# Altium project V5_BASE_V17.PrjPcb
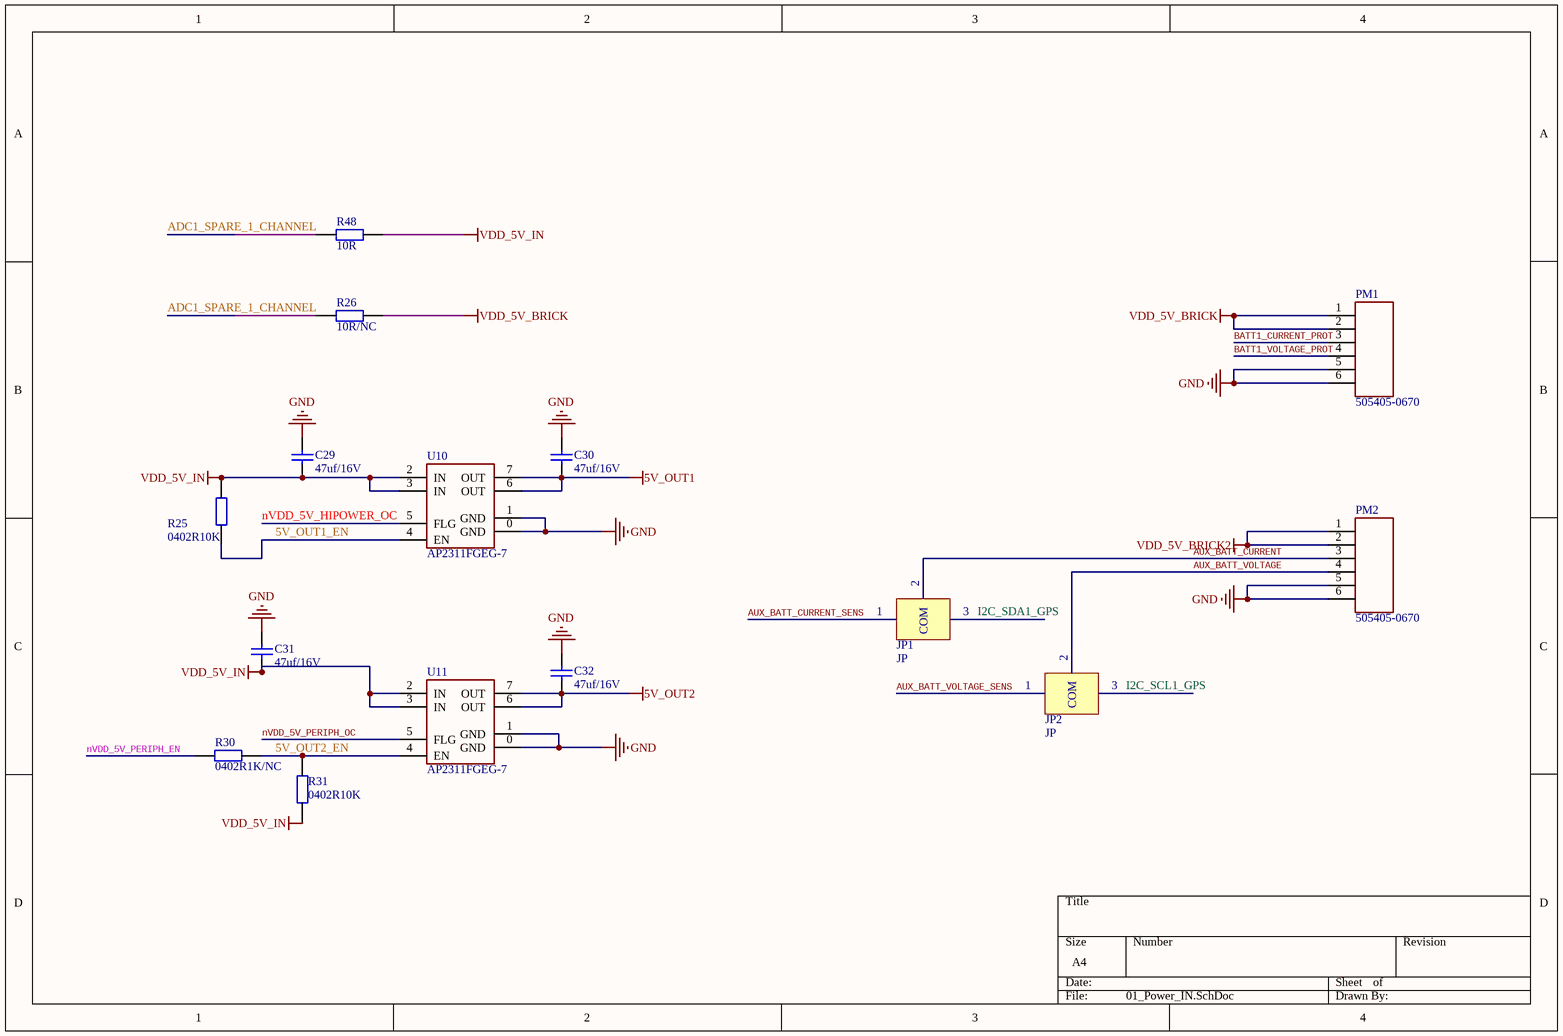
[diagram p0: 01_Power_IN.SchDoc]
6 sheets, 133 parts. Net scope: global (net labels, ports and power ports of the same name join across sheets).
Board file: V5_BASE_V17.PcbDoc
Sheets:
  01_Power_IN.SchDoc
  02_B_TO_B_CON.SchDoc
  03_Power_Switch.SchDoc
  05_DATA_IO.SchDoc
  06_PWM_IO.SchDoc
  08_PX4IO_V2.SchDoc

## Sheet 01_Power_IN.SchDoc
size A4

### Parts
C29  47uf/16V  [0805CAP]
C30  47uf/16V  [0805CAP]
C31  47uf/16V  [0805CAP]
C32  47uf/16V  [0805CAP]
JP1  JP  [0402R-SR]
JP2  JP  [0402R-SR]
PM1  505405-0670  [5054050660]
PM2  505405-0670  [5054050660]
R25  0402R10K  [0402R]
R26  10R/NC  [0402R]
R30  0402R1K/NC  [0402R]
R31  0402R10K  [0402R]
R48  10R  [0402R]
U10  AP2311FGEG-7  [QFN8_0.65]
U11  AP2311FGEG-7  [QFN8_0.65]

### Nets
5V_OUT1: C30.1 U10.6(OUT) U10.7(OUT)
5V_OUT2: C32.1 U11.6(OUT) U11.7(OUT)
GND: C29.2 C30.2 C31.2 C32.2 PM1.5 PM1.6 PM2.5 PM2.6 U10.0(GND) U10.1(GND) U11.0(GND) U11.1(GND)
VDD_5V_BRICK: PM1.1 PM1.2 R26.2
VDD_5V_BRICK2: PM2.1 PM2.2
VDD_5V_IN: C29.1 C31.1 R25.2 R31.2 R48.2 U10.2(IN) U10.3(IN) U11.2(IN) U11.3(IN)
5V_OUT1_EN: R25.1 U10.4(EN)
5V_OUT2_EN: R30.1 R31.1 U11.4(EN)
ADC1_SPARE_1_CHANNEL: R26.1 R48.1
AUX_BATT_CURRENT: JP1.2(COM) PM2.3
AUX_BATT_CURRENT_SENS: JP1.1
AUX_BATT_VOLTAGE: JP2.2(COM) PM2.4
AUX_BATT_VOLTAGE_SENS: JP2.1
BATT1_CURRENT_PROT: PM1.3
BATT1_VOLTAGE_PROT: PM1.4
I2C_SCL1_GPS: JP2.3
I2C_SDA1_GPS: JP1.3
nVDD_5V_HIPOWER_OC: U10.5(FLG)
nVDD_5V_PERIPH_EN: R30.2
nVDD_5V_PERIPH_OC: U11.5(FLG)

### Library data of the parts
C29-C32 = Cap: Capacitor
JP1 JP2 = 0402R-SR
PM1 PM2 = 5054050660
R25 R26 R30 R31 R48 = 0402R1K: 0402R1K 1%

## Sheet 02_B_TO_B_CON.SchDoc: PixHack V5 Base v1.82
size A4; CompanyName: CUAV Ltd; DrawnBy: bin; Revision: V1.82
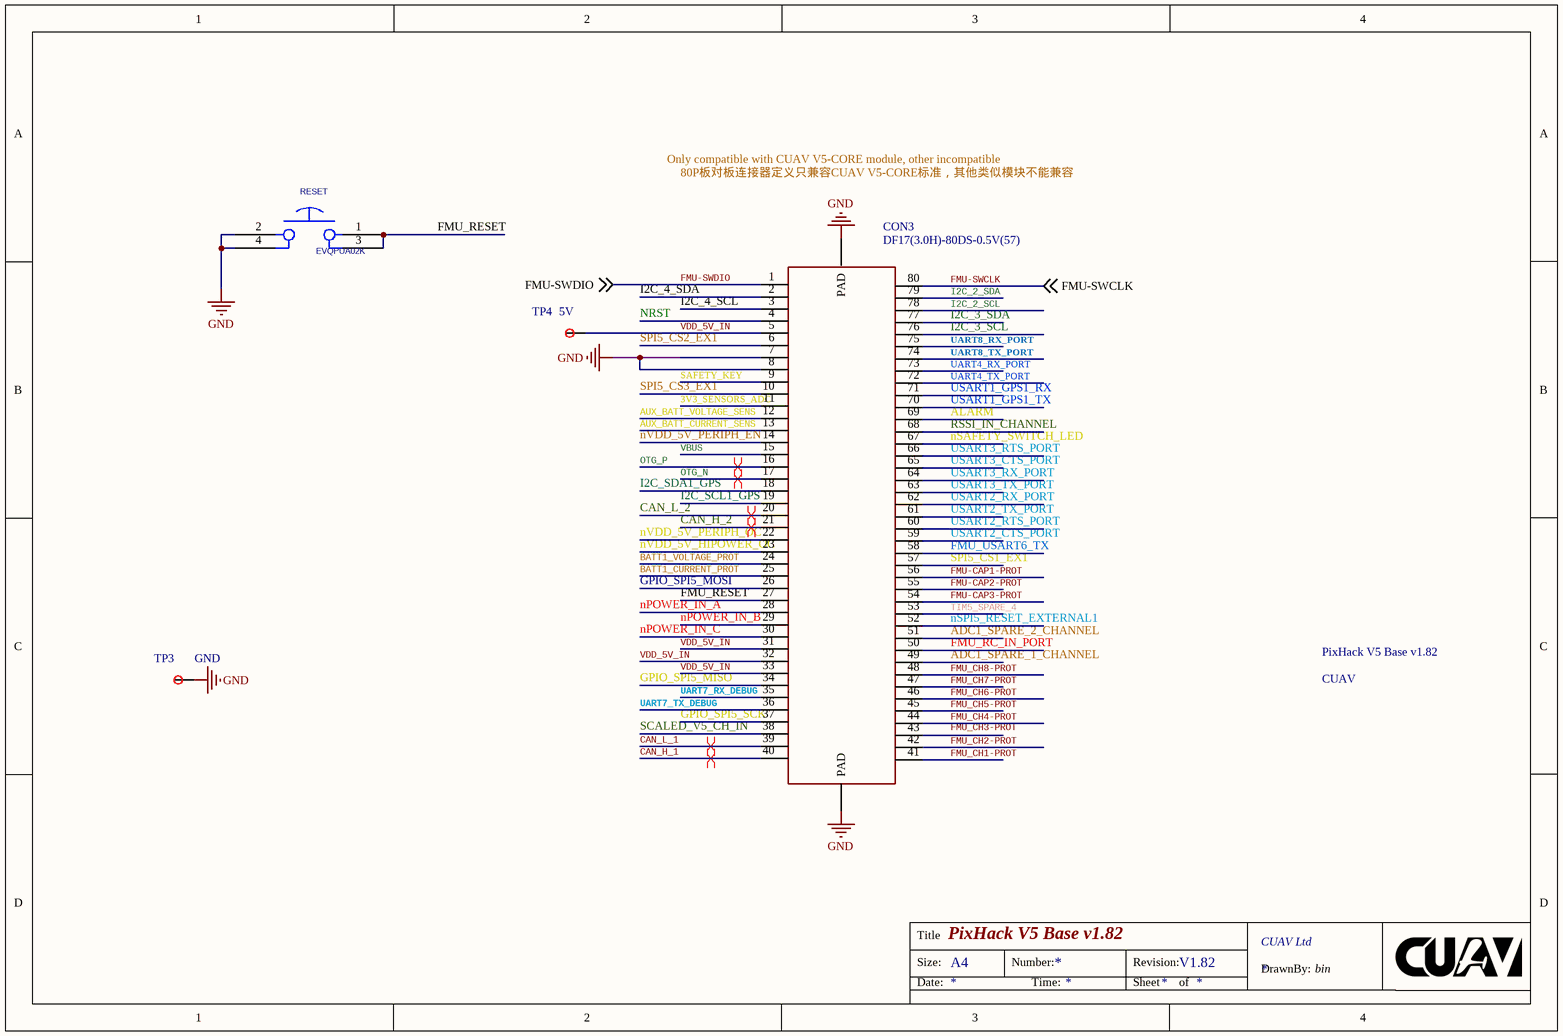
[diagram p1: 02_B_TO_B_CON.SchDoc]

### Parts
CON3  DF17(3.0H)-80DS-0.5V(57)  [DF17(3.0H)-80DS-0.5V(57)]
PixHack_V5_Base_v1.82  CUAV  [CUAV_G]
RESET  EVQPUA02K  [SKRPAB]
TP3  GND  [TP0.75]
TP4  5V  [TP0.75]

### Nets
GND: CON3.7 CON3.8 CON3.PAD RESET.2 RESET.4 TP3.0
VBUS: CON3.15
VDD_5V_IN: CON3.5 CON3.31 CON3.32 CON3.33 TP4.0
3V3_SENSORS_ADC: CON3.11
ADC1_SPARE_1_CHANNEL: CON3.49
ADC1_SPARE_2_CHANNEL: CON3.51
ALARM: CON3.69
AUX_BATT_CURRENT_SENS: CON3.13
AUX_BATT_VOLTAGE_SENS: CON3.12
BATT1_CURRENT_PROT: CON3.25
BATT1_VOLTAGE_PROT: CON3.24
CAN_H_1: CON3.40
CAN_H_2: CON3.21
CAN_L_1: CON3.39
CAN_L_2: CON3.20
FMU-CAP1-PROT: CON3.56
FMU-CAP2-PROT: CON3.55
FMU-CAP3-PROT: CON3.54
FMU-SWCLK: CON3.80 ; off-sheet FMU-SWCLK
FMU-SWDIO: CON3.1 ; off-sheet FMU-SWDIO
FMU_CH1-PROT: CON3.41
FMU_CH2-PROT: CON3.42
FMU_CH4-PROT: CON3.44
FMU_CH5-PROT: CON3.45
FMU_CH6-PROT: CON3.46
FMU_CH7-PROT: CON3.47
FMU_CH8-PROT: CON3.48
FMU_RC_IN_PORT: CON3.50
FMU_RESET: CON3.27 RESET.1 RESET.3
FMU_USART6_TX: CON3.58
GPIO_SPI5_MISO: CON3.34
GPIO_SPI5_MOSI: CON3.26
GPIO_SPI5_SCK: CON3.37
I2C_2_SCL: CON3.78
I2C_2_SDA: CON3.79
I2C_3_SCL: CON3.76
I2C_3_SDA: CON3.77
I2C_4_SCL: CON3.3
I2C_4_SDA: CON3.2
I2C_SCL1_GPS: CON3.19
I2C_SDA1_GPS: CON3.18
nPOWER_IN_A: CON3.28
nPOWER_IN_B: CON3.29
nPOWER_IN_C: CON3.30
NRST: CON3.4
nSAFETY_SWITCH_LED: CON3.67
nSPI5_RESET_EXTERNAL1: CON3.52
nVDD_5V_HIPOWER_OC: CON3.23
nVDD_5V_PERIPH_EN: CON3.14
nVDD_5V_PERIPH_OC: CON3.22
OTG_N: CON3.17
OTG_P: CON3.16
RSSI_IN_CHANNEL: CON3.68
SAFETY_KEY: CON3.9
SCALED_V5_CH_IN: CON3.38
SPI5_CS1_EX1: CON3.57
SPI5_CS2_EX1: CON3.6
SPI5_CS3_EX1: CON3.10
TIM5_SPARE_4: CON3.53
UART4_RX_PORT: CON3.73
UART4_TX_PORT: CON3.72
UART7_RX_DEBUG: CON3.35
UART7_TX_DEBUG: CON3.36
UART8_RX_PORT: CON3.75
UART8_TX_PORT: CON3.74
USART1_GPS1_RX: CON3.71
USART1_GPS1_TX: CON3.70
USART2_CTS_PORT: CON3.59
USART2_RTS_PORT: CON3.60
USART2_RX_PORT: CON3.62
USART2_TX_PORT: CON3.61
USART3_CTS_PORT: CON3.65
USART3_RTS_PORT: CON3.66
USART3_RX_PORT: CON3.64
USART3_TX_PORT: CON3.63

Not connected (* = marked no-connect by the designer): CON3 43

### Layout directives
differential pair: CAN_H_1, CAN_H_2, CAN_L_1, CAN_L_2, OTG_N, OTG_P

### Notes on the sheet
- Labels drawn without touching a wire or pin: 80P板对板连接器定义只兼容CUAV V5-CORE标准，其他类似模块不能兼容, FMU_CH3-PROT, Only compatible with CUAV V5-CORE module, other incompatible
- Title
- Size:
- Date:
- A4
- Number:
- Time:
- Revision:
- Sheet
- of
- DrawnBy:

### Library data of the parts
RESET = EDGE_MOUNT_PB_SW_2: SW SPST NO PB 2.2N SIDE 12V 50MA SMT; CLASS: IC; CAD_APPROVED: Yes; MFG_NAME01: PANASONIC; AGILE_PN: 510-76838; HEIGHT: 1.95MM; ROHS: Yes; MFG_PN01: EVQPUA02K
TP3 TP4 = TP_0.75: TP_0.75MM

## Sheet 03_Power_Switch.SchDoc
size A4
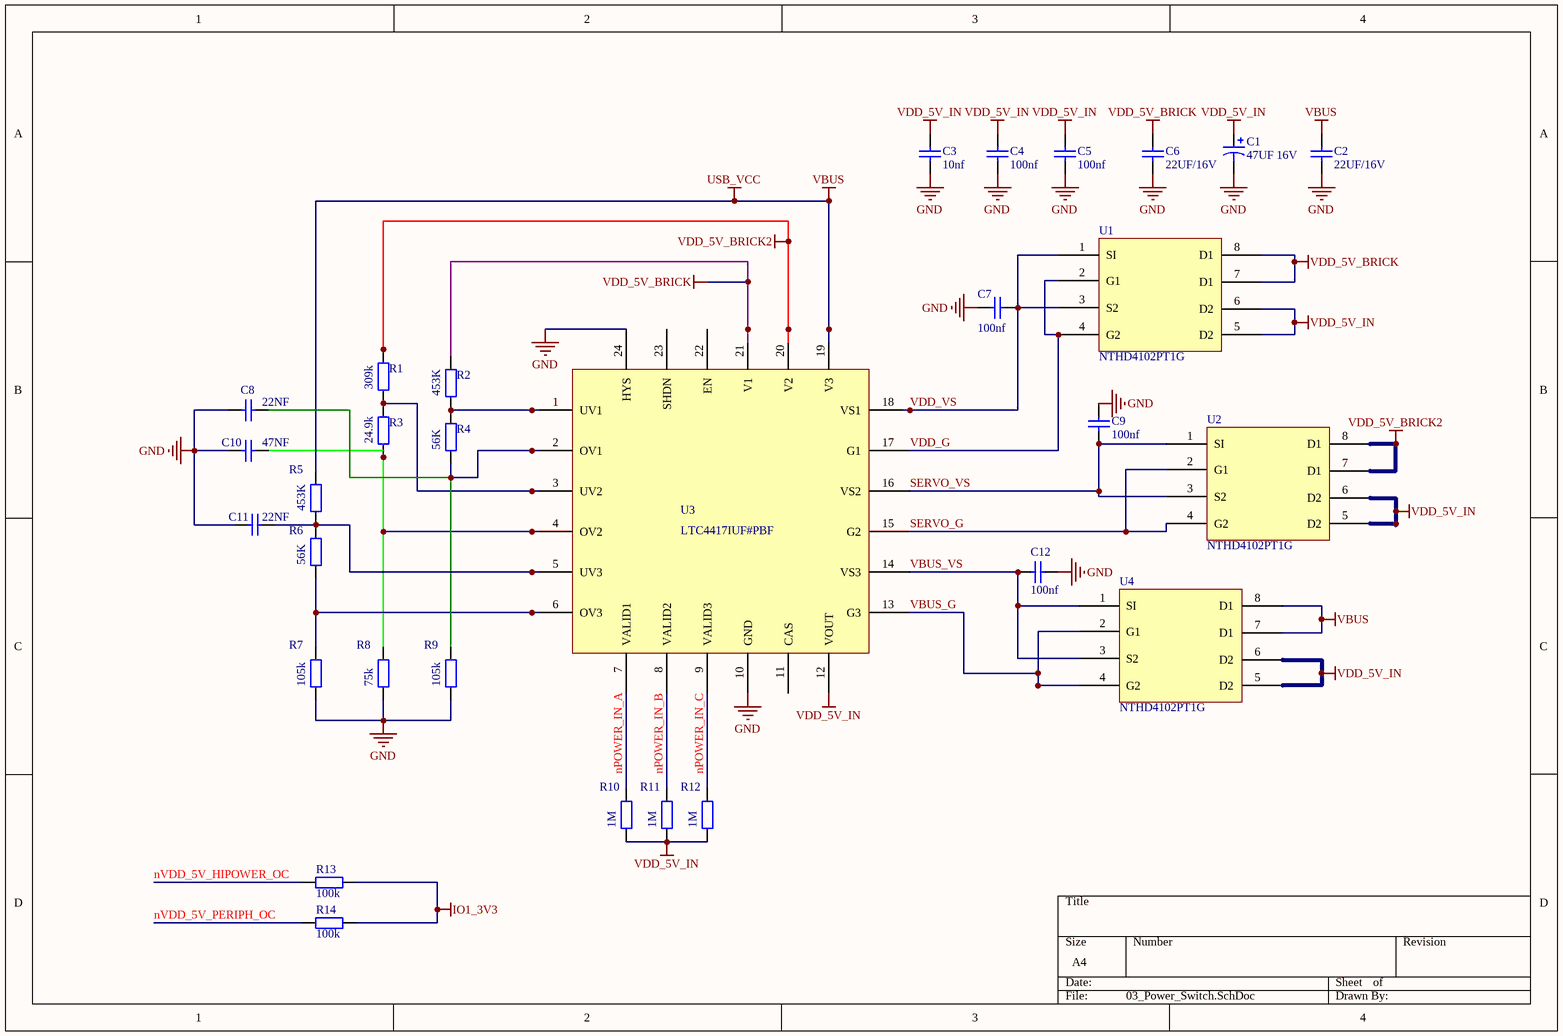
[diagram p2: 03_Power_Switch.SchDoc]

### Parts
C1  47UF 16V  [7343CAP]
C2  22UF/16V  [0805CAP]
C3  10nf  [0402CAP]
C4  100nf  [0402CAP]
C5  100nf  [0402CAP]
C6  22UF/16V  [0805CAP]
C7  100nf  [0402CAP]
C8  22NF  [0402CAP]
C9  100nf  [0402CAP]
C10  47NF  [0402CAP]
C11  22NF  [0402CAP]
C12  100nf  [0402CAP]
R1  309k  [R0402]
R2  453K  [R0402]
R3  24.9k  [R0402]
R4  56K  [R0402]
R5  453K  [R0402]
R6  56K  [R0402]
R7  105k  [R0402]
R8  75k  [R0402]
R9  105k  [R0402]
R10  1M  [R0402]
R11  1M  [R0402]
R12  1M  [R0402]
R13  100k  [R0402]
R14  100k  [R0402]
U1  NTHD4102PT1G  [1206-8]
U2  NTHD4102PT1G  [1206-8]
U3  LTC4417IUF#PBF  [QFN24]
U4  NTHD4102PT1G  [1206-8]

### Nets
GND: C1.C C2.1 C3.1 C4.1 C5.1 C6.1 C7.2 C8.2 C9.2 C10.2 C11.2 C12.2 R7.1 R8.1 R9.1 U3.10(GND) U3.24(HYS)
IO1_3V3: R13.2 R14.2
VBUS: C2.2 R5.2 U3.19(V3) U4.7(D1) U4.8(D1)  [also labelled USB_VCC]
VDD_5V_BRICK: C6.2 R2.2 U1.7(D1) U1.8(D1) U3.21(V1)
VDD_5V_BRICK2: R1.2 U2.7(D1) U2.8(D1) U3.20(V2)
VDD_5V_IN: C1.A C3.2 C4.2 C5.2 R10.1 R11.1 R12.1 U1.5(D2) U1.6(D2) U2.5(D2) U2.6(D2) U3.12(VOUT) U4.5(D2) U4.6(D2)
nPOWER_IN_A: R10.2 U3.7(VALID1)
nPOWER_IN_B: R11.2 U3.8(VALID2)
nPOWER_IN_C: R12.2 U3.9(VALID3)
nVDD_5V_HIPOWER_OC: R13.1
nVDD_5V_PERIPH_OC: R14.1
SERVO_G: U2.2(G1) U2.4(G2) U3.15(G2)
SERVO_VS: C9.1 U2.1(SI) U2.3(S2) U3.16(VS2)
VBUS_G: U3.13(G3) U4.2(G1) U4.4(G2)
VBUS_VS: C12.1 U3.14(VS3) U4.1(SI) U4.3(S2)
VDD_G: U1.2(G1) U1.4(G2) U3.17(G1)
VDD_VS: C7.1 U1.1(SI) U1.3(S2) U3.18(VS1)
NetC8_1: C8.1 R4.1 R9.2 U3.2(OV1)
NetC10_1: C10.1 R3.1 R8.2 U3.4(OV2)
NetC11_1: C11.1 R5.1 R6.2 U3.5(UV3)
NetR1_1: R1.1 R3.2 U3.3(UV2)
NetR2_1: R2.1 R4.2 U3.1(UV1)
NetR6_1: R6.1 R7.2 U3.6(OV3)

Not connected (* = marked no-connect by the designer): U3 11(CAS) 22(EN) 23(SHDN)

### Library data of the parts
C1 = Cap Pol1: Polarized Capacitor (Radial); Value: 100pF; Published: 8-Jun-2000; LatestRevisionDate: 17-Jul-2002; LatestRevisionNote: Re-released for DXP Platform.; PackageReference: RB7.6-15; Publisher: Altium Limited; PackageDescription: Polarized Capacitor (Radial); 2 Leads
C2-C12 = Cap: Value: 100pF; Published: 8-Jun-2000; LatestRevisionDate: 17-Jul-2002; LatestRevisionNote: Re-released for DXP Platform.; PackageReference: RAD-0.3; Publisher: Altium Limited; PackageDescription: Radial Cap, Thru-Hole; 2 Leads; 0.3 in Pin Spacing
R1-R14 = Res2: Resistor; Value: 1K; Published: 8-Jun-2000; LatestRevisionDate: 17-Jul-2002; LatestRevisionNote: Re-released for DXP Platform.; PackageReference: AXIAL-0.4; Publisher: Altium Limited; PackageDescription: Axial Device, Thru-Hole; 2 Leads; 0.4 in Pin Spacing

## Sheet 05_DATA_IO.SchDoc
size A3
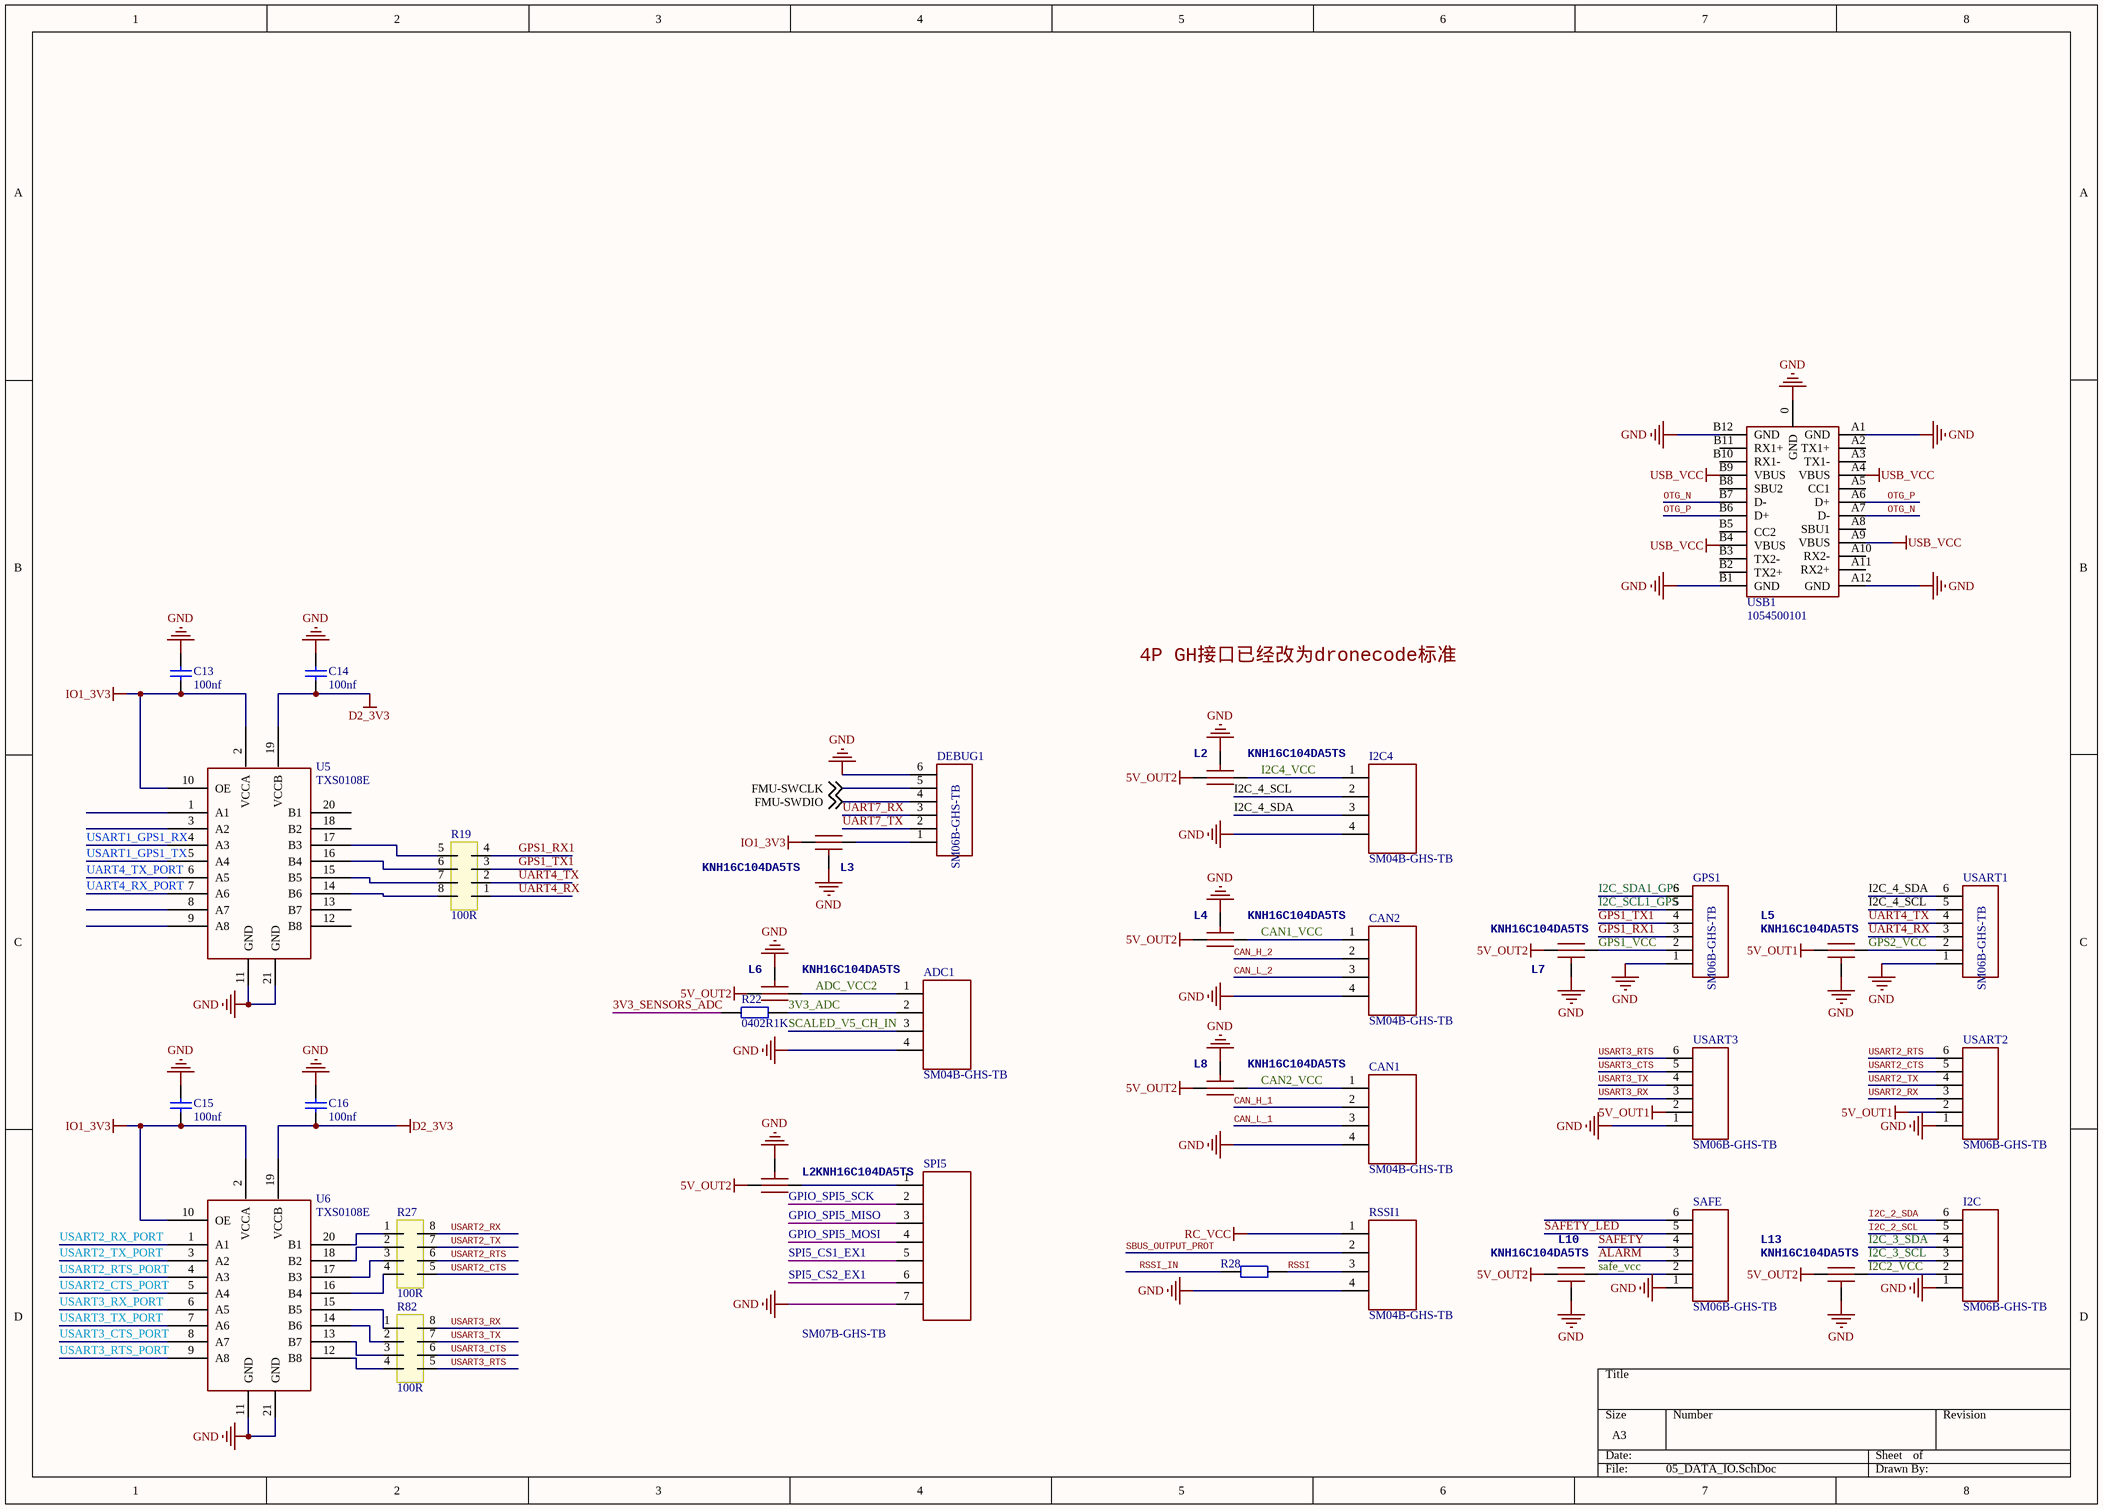
[diagram p3: 05_DATA_IO.SchDoc]

### Parts
(Parts that share a designator on the sheet are numbered #1, #2 ... from top to bottom, then left to right.)
ADC1  SM04B-GHS-TB  [BM04B-GHS_DC]
C13  100nf  [0402CAP]
C14  100nf  [0402CAP]
C15  100nf  [0402CAP]
C16  100nf  [0402CAP]
CAN1  SM04B-GHS-TB  [BM04B-GHS_DC]
CAN2  SM04B-GHS-TB  [BM04B-GHS_DC]
DEBUG1  SM06B-GHS-TB  [BM06B-GHS_DC]
GPS1  SM06B-GHS-TB  [SM06B-GHS-TB]
I2C  SM06B-GHS-TB  [SM06B-GHS-TB]
I2C4  SM04B-GHS-TB  [BM04B-GHS_DC]
L2#1  KNH16C104DA5TS  [KYOCERA-KNH16-DA]
L2#2  KNH16C104DA5TS  [KYOCERA-KNH16-DA]
L3  KNH16C104DA5TS  [KYOCERA-KNH16-DA]
L4  KNH16C104DA5TS  [KYOCERA-KNH16-DA]
L5  KNH16C104DA5TS  [KYOCERA-KNH16-DA]
L6  KNH16C104DA5TS  [KYOCERA-KNH16-DA]
L7  KNH16C104DA5TS  [KYOCERA-KNH16-DA]
L8  KNH16C104DA5TS  [KYOCERA-KNH16-DA]
L10  KNH16C104DA5TS  [KYOCERA-KNH16-DA]
L13  KNH16C104DA5TS  [KYOCERA-KNH16-DA]
R19  100R  [0402_4r]
R22  0402R1K  [0402R]
R27#1  100R  [0402_4r]
R28#1  0402R100R  [0402R]  (value not drawn)
R82  100R  [0402_4r]
RSSI1  SM04B-GHS-TB  [BM04B-GHS_DC]
SAFE  SM06B-GHS-TB  [SM06B-GHS-TB]
SPI5  SM07B-GHS-TB  [SM07B-GHS]
U5  TXS0108E  [VQFN20]
U6  TXS0108E  [VQFN20]
USART1  SM06B-GHS-TB  [SM06B-GHS-TB]
USART2  SM06B-GHS-TB  [SM06B-GHS-TB]
USART3  SM06B-GHS-TB  [SM06B-GHS-TB]
USB1  1054500101  [1054500101]

### Nets
5V_OUT1: L5.P$1 USART2.2 USART3.2
5V_OUT2: L2#1.P$2 L2#2.P$2 L4.P$2 L6.P$2 L7.P$1 L8.P$2 L10.P$1 L13.P$1
D2_3V3: C14.2 C16.2 U5.19(VCCB) U6.19(VCCB)
GND: ADC1.4 C13.1 C14.1 C15.1 C16.1 CAN1.4 CAN2.4 DEBUG1.6 GPS1.1 I2C.1 I2C4.4 L2#1.GND L2#2.GND L3.GND L4.GND L5.GND L6.GND L7.GND L8.GND L10.GND L13.GND RSSI1.4 SAFE.1 SPI5.7 U5.11(GND) U5.21(GND) U6.11(GND) U6.21(GND) USART1.1 USART2.1 USART3.1 USB1.0(GND) USB1.A1(GND) USB1.A12(GND) USB1.B1(GND) USB1.B12(GND)
IO1_3V3: C13.2 C15.2 L3.P$1 U5.2(VCCA) U5.10(OE) U6.2(VCCA) U6.10(OE)
RC_VCC: RSSI1.1
USB_VCC: USB1.A4(VBUS) USB1.A9(VBUS) USB1.B4(VBUS) USB1.B9(VBUS)  [project net VBUS]
3V3_ADC: ADC1.2 R22.2
3V3_SENSORS_ADC: R22.1
ADC_VCC2: ADC1.1 L6.P$1
ALARM: SAFE.3
CAN1_VCC: CAN2.1 L4.P$1
CAN2_VCC: CAN1.1 L8.P$1
CAN_H_1: CAN1.2
CAN_H_2: CAN2.2
CAN_L_1: CAN1.3
CAN_L_2: CAN2.3
FMU-SWCLK: DEBUG1.5 ; off-sheet FMU-SWCLK
FMU-SWDIO: DEBUG1.4 ; off-sheet FMU-SWDIO
GPIO_SPI5_MISO: SPI5.3
GPIO_SPI5_MOSI: SPI5.4
GPIO_SPI5_SCK: SPI5.2
GPS1_RX1: GPS1.3 R19.4
GPS1_TX1: GPS1.4 R19.3
GPS1_VCC: GPS1.2 L7.P$2
GPS2_VCC: L5.P$2 USART1.2
I2C2_VCC: I2C.2 L13.P$2
I2C4_VCC: I2C4.1 L2#1.P$1
I2C_2_SCL: I2C.5
I2C_2_SDA: I2C.6
I2C_3_SCL: I2C.3
I2C_3_SDA: I2C.4
I2C_4_SCL: I2C4.2 USART1.5
I2C_4_SDA: I2C4.3 USART1.6
I2C_SCL1_GPS: GPS1.5
I2C_SDA1_GPS: GPS1.6
OTG_N: USB1.A7(D-) USB1.B7(D-)
OTG_P: USB1.A6(D+) USB1.B6(D+)
RSSI: R28#1.2 RSSI1.3
RSSI_IN: R28#1.1
safe_vcc: L10.P$2 SAFE.2
SAFETY: SAFE.4
SAFETY_LED: SAFE.5
SBUS_OUTPUT_PROT: RSSI1.2
SCALED_V5_CH_IN: ADC1.3
SPI5_CS1_EX1: SPI5.5
SPI5_CS2_EX1: SPI5.6
UART4_RX: R19.1 USART1.3
UART4_RX_PORT: U5.7(A6)
UART4_TX: R19.2 USART1.4
UART4_TX_PORT: U5.6(A5)
UART7_RX: DEBUG1.3
UART7_TX: DEBUG1.2
USART1_GPS1_RX: U5.4(A3)
USART1_GPS1_TX: U5.5(A4)
USART2_CTS: R27#1.5 USART2.5
USART2_CTS_PORT: U6.5(A4)
USART2_RTS: R27#1.6 USART2.6
USART2_RTS_PORT: U6.4(A3)
USART2_RX: R27#1.8 USART2.3
USART2_RX_PORT: U6.1(A1)
USART2_TX: R27#1.7 USART2.4
USART2_TX_PORT: U6.3(A2)
USART3_CTS: R82.6 USART3.5
USART3_CTS_PORT: U6.8(A7)
USART3_RTS: R82.5 USART3.6
USART3_RTS_PORT: U6.9(A8)
USART3_RX: R82.8 USART3.3
USART3_RX_PORT: U6.6(A5)
USART3_TX: R82.7 USART3.4
USART3_TX_PORT: U6.7(A6)
NetDEBUG1_1: DEBUG1.1 L3.P$2
NetL2#2_P$1: L2#2.P$1 SPI5.1
NetR19_5: R19.5 U5.17(B3)
NetR19_6: R19.6 U5.16(B4)
NetR19_7: R19.7 U5.15(B5)
NetR19_8: R19.8 U5.14(B6)
NetR27#1_1: R27#1.1 U6.20(B1)
NetR27#1_2: R27#1.2 U6.18(B2)
NetR27#1_3: R27#1.3 U6.17(B3)
NetR27#1_4: R27#1.4 U6.16(B4)
NetR82_1: R82.1 U6.15(B5)
NetR82_2: R82.2 U6.14(B6)
NetR82_3: R82.3 U6.13(B7)
NetR82_4: R82.4 U6.12(B8)

Not connected (* = marked no-connect by the designer): SAFE 6; U5 1(A1) 3(A2) 8(A7) 9(A8) 12(B8) 13(B7) 18(B2) 20(B1); USB1 A2(TX1+) A3(TX1-) A5(CC1) A8(SBU1) A10(RX2-) A11(RX2+) B2(TX2+) B3(TX2-) B5(CC2) B8(SBU2) B10(RX1-) B11(RX1+)

### Notes on the sheet
- Labels drawn without touching a wire or pin: 4P GH接口已经改为dronecode标准

### Library data of the parts
C13-C16 = Cap
CAN1 CAN2 I2C4 RSSI1 = SM04B-GHS-TB: dronecode
DEBUG1 = SM06B-GHS-TB: dronecode
L2#1 L2#2 L3-L8 L10 L13 = KNH16C104DA5TS: Capacitor, Filter, 0.1uF, 25V, 2A, 0603, SMD; 3DR_PARTNO: ECM0719; Supplier 1: Digi-Key
R19 R27#1 R82 = 0402-8R-4R
R22 = 0402R1K: 0402R1K 1%
R28#1 = 0402R100R: 0402R100R 1%

## Sheet 06_PWM_IO.SchDoc
size A4
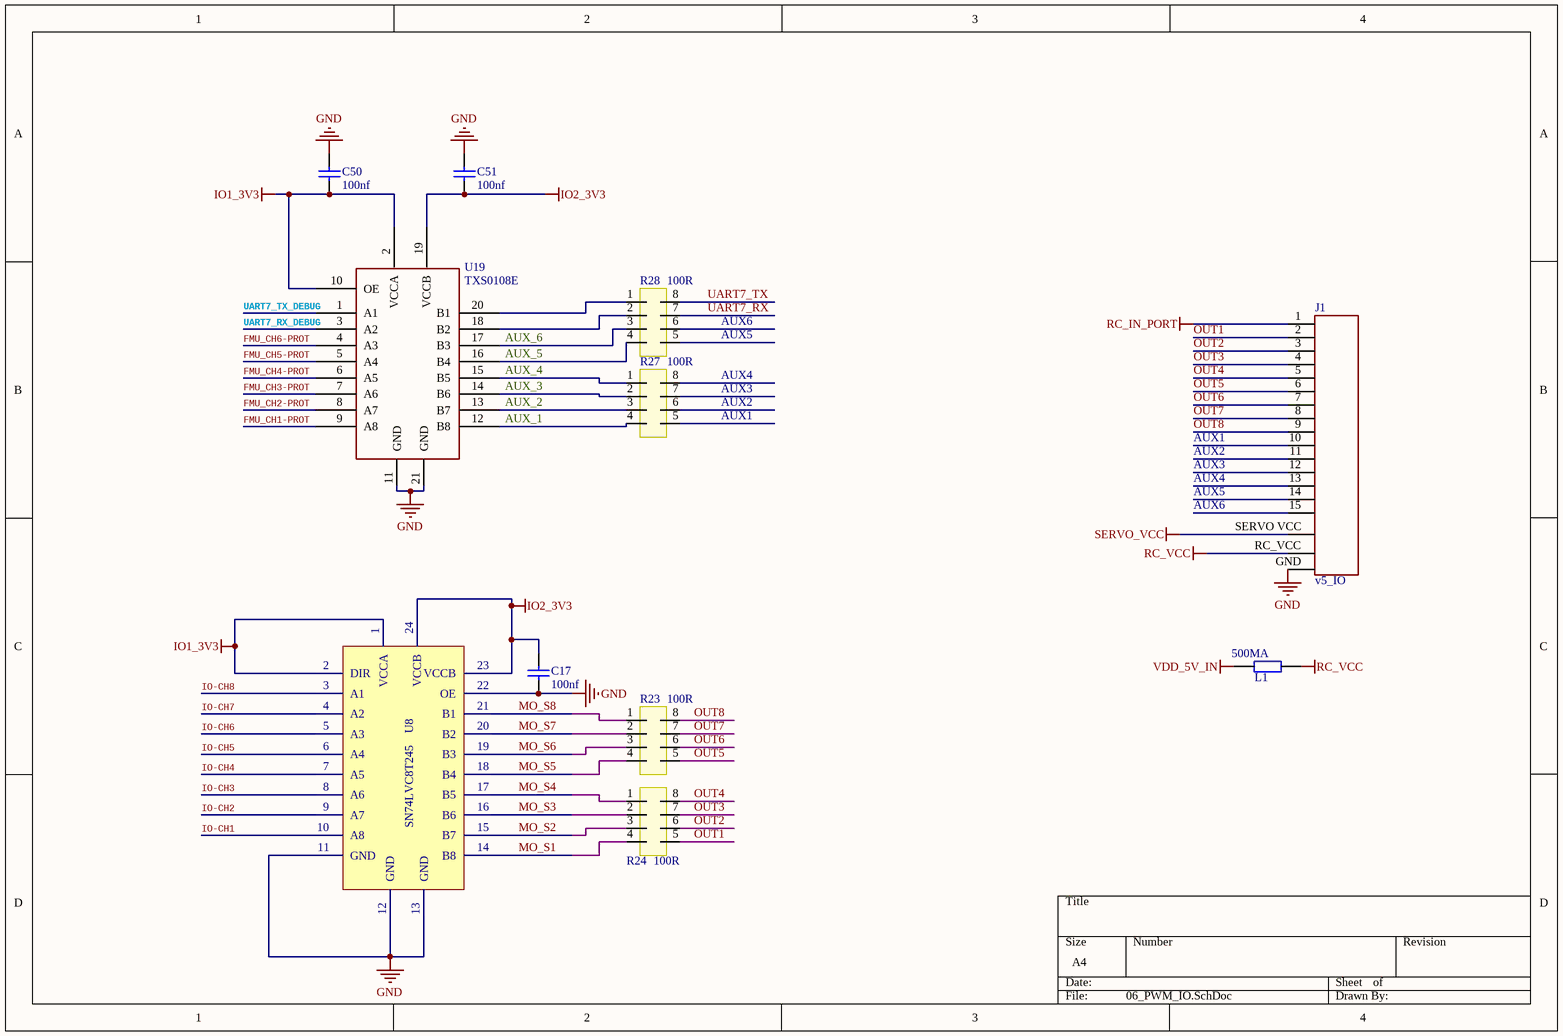
[diagram p4: 06_PWM_IO.SchDoc]

### Parts
(Parts that share a designator on the sheet are numbered #1, #2 ... from top to bottom, then left to right.)
C17  100nf  [0402CAP]
C50  100nf  [0402CAP]
C51  100nf  [0402CAP]
J1  v5_IO  [V5_IO_PWM]
L1  500MA  [0805l]
R23  100R  [0402_4r]
R24  100R  [0402_4r]
R27#2  100R  [0402_4r]
R28#2  100R  [0402_4r]
U8  SN74LVC8T245  [QFN24-RGY]
U19  TXS0108E  [VQFN20]

### Nets
GND: C17.1 C50.1 C51.1 J1.GND U8.11(GND) U8.12(GND) U8.13(GND) U8.22(OE) U19.11(GND) U19.21(GND)
IO1_3V3: C50.2 U8.1(VCCA) U8.2(DIR) U19.2(VCCA) U19.10(OE)
IO2_3V3: C17.2 C51.2 U8.23(VCCB) U8.24(VCCB) U19.19(VCCB)
RC_IN_PORT: J1.1
RC_VCC: J1.RC_VCC L1.1
SERVO_VCC: J1.SERVO_VCC
VDD_5V_IN: L1.2
AUX1: J1.10 R27#2.5
AUX2: J1.11 R27#2.6
AUX3: J1.12 R27#2.7
AUX4: J1.13 R27#2.8
AUX5: J1.14 R28#2.5
AUX6: J1.15 R28#2.6
AUX_1: R27#2.4 U19.12(B8)
AUX_2: R27#2.3 U19.13(B7)
AUX_3: R27#2.2 U19.14(B6)
AUX_4: R27#2.1 U19.15(B5)
AUX_5: R28#2.4 U19.16(B4)
AUX_6: R28#2.3 U19.17(B3)
FMU_CH1-PROT: U19.9(A8)
FMU_CH2-PROT: U19.8(A7)
FMU_CH3-PROT: U19.7(A6)
FMU_CH4-PROT: U19.6(A5)
FMU_CH5-PROT: U19.5(A4)
FMU_CH6-PROT: U19.4(A3)
IO-CH1: U8.10(A8)
IO-CH2: U8.9(A7)
IO-CH3: U8.8(A6)
IO-CH4: U8.7(A5)
IO-CH5: U8.6(A4)
IO-CH6: U8.5(A3)
IO-CH7: U8.4(A2)
IO-CH8: U8.3(A1)
MO_S1: R24.4 U8.14(B8)
MO_S2: R24.3 U8.15(B7)
MO_S3: R24.2 U8.16(B6)
MO_S4: R24.1 U8.17(B5)
MO_S5: R23.4 U8.18(B4)
MO_S6: R23.3 U8.19(B3)
MO_S7: R23.2 U8.20(B2)
MO_S8: R23.1 U8.21(B1)
OUT1: J1.2 R24.5
OUT2: J1.3 R24.6
OUT3: J1.4 R24.7
OUT4: J1.5 R24.8
OUT5: J1.6 R23.5
OUT6: J1.7 R23.6
OUT7: J1.8 R23.7
OUT8: J1.9 R23.8
UART7_RX: R28#2.7
UART7_RX_DEBUG: U19.3(A2)
UART7_TX: R28#2.8
UART7_TX_DEBUG: U19.1(A1)
NetR28#2_1: R28#2.1 U19.20(B1)
NetR28#2_2: R28#2.2 U19.18(B2)

### Library data of the parts
C17 = Cap: Value: 100pF; Published: 8-Jun-2000; LatestRevisionDate: 17-Jul-2002; LatestRevisionNote: Re-released for DXP Platform.; PackageReference: RAD-0.3; Publisher: Altium Limited; PackageDescription: Radial Cap, Thru-Hole; 2 Leads; 0.3 in Pin Spacing
C50 C51 = Cap
L1 = 0402R100R: 0402R100R 1%
R23 R24 R27#2 R28#2 = 0402-8R-4R

## Sheet 08_PX4IO_V2.SchDoc
size A4
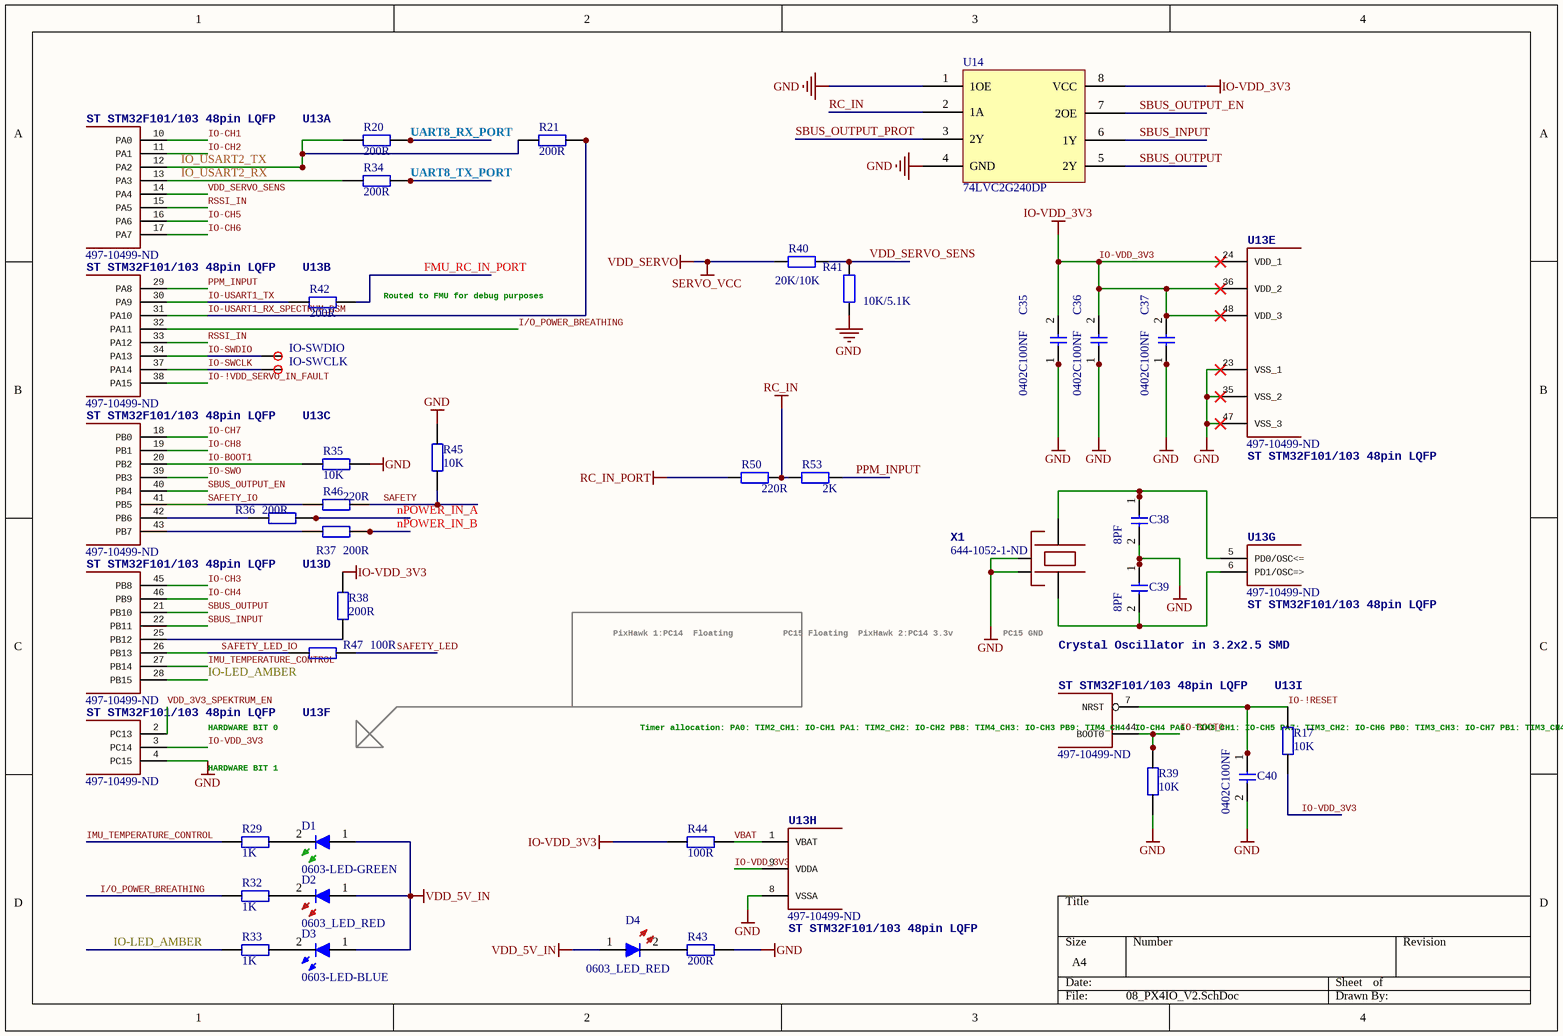
[diagram p5: 08_PX4IO_V2.SchDoc]

### Parts
C35  0402C100NF  [0402C]
C36  0402C100NF  [0402C]
C37  0402C100NF  [0402C]
C38  8PF  [0402C]
C39  8PF  [0402C]
C40  0402C100NF  [0402C]
D1  0603-LED-GREEN  [0603-LED-Green]
D2  0603_LED_RED  [0603-LED-RED]
D3  0603-LED-BLUE  [0603-LED-blue]
D4  0603_LED_RED  [0603-LED-RED]
IO-SWCLK  TP_0.75  [TP0.75]  (value not drawn)
IO-SWDIO  TP_0.75  [TP0.75]  (value not drawn)
R17  10K  [0402R]
R20  200R  [0402R]
R21  200R  [0402R]
R29  1K  [0402R]
R32  1K  [0402R]
R33  1K  [0402R]
R34  200R  [0402R]
R35  10K  [0402R]
R36  200R  [0402R]
R37  200R  [0402R]
R38  200R  [0402R]
R39  10K  [0402R]
R40  20K/10K  [R0402]
R41  10K/5.1K  [R0402]
R42  200R  [0402R]
R43  200R  [0402R]
R44  100R  [0402R]
R45  10K  [0402R]
R46  220R  [0402R]
R47  100R  [0402R]
R50  220R  [R0402]
R53  2K  [R0402]
U13  ST STM32F101/103 48pin LQFP  Supplier Part Number 1: 497-10499-ND  [TQFP48]  (parts A,B,C,D,E,F,G,H,I of 9)
U14  74LVC2G240DP  [TSSOP8]
X1  Crystal Oscillator in 3.2x2.5 SMD  Supplier Part Number 1: 644-1052-1-ND  [3225]

### Nets
GND: C35.1 C36.1 C37.1 C38.2 C39.1 C40.2 R35.2 R39.1 R41.1 R43.2 R45.2 U13.4(PC15) U13.8(VSSA) U13.23(VSS_1) U13.35(VSS_2) U13.47(VSS_3) U14.1(1OE) U14.4(GND) X1.2(NC_2) X1.4(NC_4)
IO-VDD_3V3: C35.2 C36.2 C37.2 R17.2 R38.2 R44.1 U13.3(PC14) U13.9(VDDA) U13.24(VDD_1) U13.36(VDD_2) U13.48(VDD_3) U14.8(VCC)
RC_IN: R50.2 R53.1 U14.2(1A)
RC_IN_PORT: R50.1
SERVO_VCC: R40.1  [also labelled VDD_SERVO]
VDD_5V_IN: D1.1 D2.1 D3.1 D4.1
FMU_RC_IN_PORT: R42.2
I/O_POWER_BREATHING: R32.1 U13.32(PA11)
IMU_TEMPERATURE_CONTROL: R29.1 U13.27(PB14)
IO-!RESET: C40.1 R17.1 U13.7(NRST)
IO-!VDD_SERVO_IN_FAULT: U13.38(PA15)
IO-BOOT0: R39.2 U13.44(BOOT0)
IO-BOOT1: R35.1 U13.20(PB2)
IO-CH1: U13.10(PA0)
IO-CH2: U13.11(PA1)
IO-CH3: U13.45(PB8)
IO-CH4: U13.46(PB9)
IO-CH5: U13.16(PA6)
IO-CH6: U13.17(PA7)
IO-CH7: U13.18(PB0)
IO-CH8: U13.19(PB1)
IO-LED_AMBER: R33.1 U13.28(PB15)
IO-SWCLK: IO-SWCLK.0 U13.37(PA14)
IO-SWDIO: IO-SWDIO.0 U13.34(PA13)
IO-SWO: U13.39(PB3)
IO-USART1_RX_SPECTRUM_DSM: R21.2 U13.31(PA10)
IO-USART1_TX: R42.1 U13.30(PA9)
IO_USART2_RX: R34.1 U13.13(PA3)
IO_USART2_TX: R20.1 R21.1 U13.12(PA2)
nPOWER_IN_A: R36.2
nPOWER_IN_B: R37.2
PPM_INPUT: R53.2 U13.29(PA8)
RSSI_IN: U13.15(PA5) U13.33(PA12)
SAFETY: R45.1 R46.1
SAFETY_IO: R46.2 U13.41(PB5)
SAFETY_LED: R47.1
SAFETY_LED_IO: R47.2 U13.26(PB13)
SBUS_INPUT: U13.22(PB11) U14.6(1Y)
SBUS_OUTPUT: U13.21(PB10) U14.5(2Y)
SBUS_OUTPUT_EN: U13.40(PB4) U14.7(2OE)
SBUS_OUTPUT_PROT: U14.3(2Y)
UART8_RX_PORT: R20.2
UART8_TX_PORT: R34.2
VBAT: R44.2 U13.1(VBAT)
VDD_3V3_SPEKTRUM_EN: U13.2(PC13)
VDD_SERVO_SENS: R40.2 R41.2 U13.14(PA4)
NetC38_1: C38.1 U13.5(PD0/OSC<=) X1.3
NetC39_2: C39.2 U13.6(PD1/OSC=>) X1.1
NetD1_2: D1.2 R29.2
NetD2_2: D2.2 R32.2
NetD3_2: D3.2 R33.2
NetD4_2: D4.2 R43.1
NetR36_1: R36.1 U13.42(PB6)
NetR37_1: R37.1 U13.43(PB7)
NetR38_1: R38.1 U13.25(PB12)

### Notes on the sheet
- (near R42) Routed to FMU for debug purposes
- PixHawk 1:PC14  Floating
  PC15 Floating
  PixHawk 2:PC14 3.3v
  PC15 GND
- HARDWARE BIT 0
- HARDWARE BIT 1
- Timer allocation:
  PA0: TIM2_CH1: IO-CH1
  PA1: TIM2_CH2: IO-CH2
  PB8: TIM4_CH3: IO-CH3
  PB9: TIM4_CH4: IO-CH4
  PA6: TIM3_CH1: IO-CH5
  PA7: TIM3_CH2: IO-CH6
  PB0: TIM3_CH3: IO-CH7
  PB1: TIM3_CH4: IO-CH8
  PA8: TIM1_CH1: PPM_IN
  PA11: TIM1_CH4: RSSI_IN

### Library data of the parts
C35-C40 = 0402C100NF: 50V 5%
IO-SWCLK IO-SWDIO = TP_0.75: TP_0.75MM
R17 R20 R21 R29 R32-R39 R42-R47 = 0402R1K: 0402R1K 1%
R40 R41 R50 R53 = Res2: Resistor; Value: 1K; Published: 8-Jun-2000; LatestRevisionDate: 17-Jul-2002; LatestRevisionNote: Re-released for DXP Platform.; PackageReference: AXIAL-0.4; Publisher: Altium Limited; PackageDescription: Axial Device, Thru-Hole; 2 Leads; 0.4 in Pin Spacing
U13 = STM32F10XCXT6: MCU 32BIT ARM 64K FLASH 48LQFP; 3DR_PARTNO: EMC0842; Supplier 1: Digi-Key
U14 = 74LVC2G240
X1 = OSCILLATOR-3.2X2.5: CRYSTAL 24MHZ 8PF SMD; 3DR_PARTNO: ECM0708; PARTNO: NX3225SA-24.000MHZ-STD-CSR-1; Supplier 1: Digi-Key; Value: 24MHz

## Nets that join several sheets
5V_OUT1: 01_Power_IN (C30.1 U10.6 U10.7), 05_DATA_IO (L5.P$1 USART2.2 USART3.2)
5V_OUT2: 01_Power_IN (C32.1 U11.6 U11.7), 05_DATA_IO (8 pins)
GND: 01_Power_IN (12 pins), 02_B_TO_B_CON (6 pins), 03_Power_Switch (17 pins), 05_DATA_IO (36 pins), 06_PWM_IO (10 pins), 08_PX4IO_V2 (20 pins)
IO1_3V3: 03_Power_Switch (R13.2 R14.2), 05_DATA_IO (7 pins), 06_PWM_IO (5 pins)
RC_IN_PORT: 06_PWM_IO (J1.1), 08_PX4IO_V2 (R50.1)
RC_VCC: 05_DATA_IO (RSSI1.1), 06_PWM_IO (J1.RC_VCC L1.1)
SERVO_VCC: 06_PWM_IO (J1.SERVO VCC), 08_PX4IO_V2 (R40.1)
VBUS: 02_B_TO_B_CON (CON3.15), 03_Power_Switch (5 pins), 05_DATA_IO (USB1.A4 USB1.A9 USB1.B4 USB1.B9)
VDD_5V_BRICK: 01_Power_IN (PM1.1 PM1.2 R26.2), 03_Power_Switch (5 pins)
VDD_5V_BRICK2: 01_Power_IN (PM2.1 PM2.2), 03_Power_Switch (R1.2 U2.7 U2.8 U3.20)
VDD_5V_IN: 01_Power_IN (9 pins), 02_B_TO_B_CON (5 pins), 03_Power_Switch (14 pins), 06_PWM_IO (L1.2), 08_PX4IO_V2 (D1.1 D2.1 D3.1 D4.1)
3V3_SENSORS_ADC: 02_B_TO_B_CON (CON3.11), 05_DATA_IO (R22.1)
ADC1_SPARE_1_CHANNEL: 01_Power_IN (R26.1 R48.1), 02_B_TO_B_CON (CON3.49)
ALARM: 02_B_TO_B_CON (CON3.69), 05_DATA_IO (SAFE.3)
AUX_BATT_CURRENT_SENS: 01_Power_IN (JP1.1), 02_B_TO_B_CON (CON3.13)
AUX_BATT_VOLTAGE_SENS: 01_Power_IN (JP2.1), 02_B_TO_B_CON (CON3.12)
BATT1_CURRENT_PROT: 01_Power_IN (PM1.3), 02_B_TO_B_CON (CON3.25)
BATT1_VOLTAGE_PROT: 01_Power_IN (PM1.4), 02_B_TO_B_CON (CON3.24)
CAN_H_1: 02_B_TO_B_CON (CON3.40), 05_DATA_IO (CAN1.2)
CAN_H_2: 02_B_TO_B_CON (CON3.21), 05_DATA_IO (CAN2.2)
CAN_L_1: 02_B_TO_B_CON (CON3.39), 05_DATA_IO (CAN1.3)
CAN_L_2: 02_B_TO_B_CON (CON3.20), 05_DATA_IO (CAN2.3)
FMU-SWCLK: 02_B_TO_B_CON (CON3.80), 05_DATA_IO (DEBUG1.5)
FMU-SWDIO: 02_B_TO_B_CON (CON3.1), 05_DATA_IO (DEBUG1.4)
FMU_CH1-PROT: 02_B_TO_B_CON (CON3.41), 06_PWM_IO (U19.9)
FMU_CH2-PROT: 02_B_TO_B_CON (CON3.42), 06_PWM_IO (U19.8)
FMU_CH4-PROT: 02_B_TO_B_CON (CON3.44), 06_PWM_IO (U19.6)
FMU_CH5-PROT: 02_B_TO_B_CON (CON3.45), 06_PWM_IO (U19.5)
FMU_CH6-PROT: 02_B_TO_B_CON (CON3.46), 06_PWM_IO (U19.4)
FMU_RC_IN_PORT: 02_B_TO_B_CON (CON3.50), 08_PX4IO_V2 (R42.2)
GPIO_SPI5_MISO: 02_B_TO_B_CON (CON3.34), 05_DATA_IO (SPI5.3)
GPIO_SPI5_MOSI: 02_B_TO_B_CON (CON3.26), 05_DATA_IO (SPI5.4)
GPIO_SPI5_SCK: 02_B_TO_B_CON (CON3.37), 05_DATA_IO (SPI5.2)
I2C_2_SCL: 02_B_TO_B_CON (CON3.78), 05_DATA_IO (I2C.5)
I2C_2_SDA: 02_B_TO_B_CON (CON3.79), 05_DATA_IO (I2C.6)
I2C_3_SCL: 02_B_TO_B_CON (CON3.76), 05_DATA_IO (I2C.3)
I2C_3_SDA: 02_B_TO_B_CON (CON3.77), 05_DATA_IO (I2C.4)
I2C_4_SCL: 02_B_TO_B_CON (CON3.3), 05_DATA_IO (I2C4.2 USART1.5)
I2C_4_SDA: 02_B_TO_B_CON (CON3.2), 05_DATA_IO (I2C4.3 USART1.6)
I2C_SCL1_GPS: 01_Power_IN (JP2.3), 02_B_TO_B_CON (CON3.19), 05_DATA_IO (GPS1.5)
I2C_SDA1_GPS: 01_Power_IN (JP1.3), 02_B_TO_B_CON (CON3.18), 05_DATA_IO (GPS1.6)
IO-CH1: 06_PWM_IO (U8.10), 08_PX4IO_V2 (U13.10)
IO-CH2: 06_PWM_IO (U8.9), 08_PX4IO_V2 (U13.11)
IO-CH3: 06_PWM_IO (U8.8), 08_PX4IO_V2 (U13.45)
IO-CH4: 06_PWM_IO (U8.7), 08_PX4IO_V2 (U13.46)
IO-CH5: 06_PWM_IO (U8.6), 08_PX4IO_V2 (U13.16)
IO-CH6: 06_PWM_IO (U8.5), 08_PX4IO_V2 (U13.17)
IO-CH7: 06_PWM_IO (U8.4), 08_PX4IO_V2 (U13.18)
IO-CH8: 06_PWM_IO (U8.3), 08_PX4IO_V2 (U13.19)
nPOWER_IN_A: 02_B_TO_B_CON (CON3.28), 03_Power_Switch (R10.2 U3.7), 08_PX4IO_V2 (R36.2)
nPOWER_IN_B: 02_B_TO_B_CON (CON3.29), 03_Power_Switch (R11.2 U3.8), 08_PX4IO_V2 (R37.2)
nPOWER_IN_C: 02_B_TO_B_CON (CON3.30), 03_Power_Switch (R12.2 U3.9)
nVDD_5V_HIPOWER_OC: 01_Power_IN (U10.5), 02_B_TO_B_CON (CON3.23), 03_Power_Switch (R13.1)
nVDD_5V_PERIPH_EN: 01_Power_IN (R30.2), 02_B_TO_B_CON (CON3.14)
nVDD_5V_PERIPH_OC: 01_Power_IN (U11.5), 02_B_TO_B_CON (CON3.22), 03_Power_Switch (R14.1)
OTG_N: 02_B_TO_B_CON (CON3.17), 05_DATA_IO (USB1.A7 USB1.B7)
OTG_P: 02_B_TO_B_CON (CON3.16), 05_DATA_IO (USB1.A6 USB1.B6)
RSSI_IN: 05_DATA_IO (R28#1.1), 08_PX4IO_V2 (U13.15 U13.33)
SAFETY: 05_DATA_IO (SAFE.4), 08_PX4IO_V2 (R45.1 R46.1)
SAFETY_LED: 05_DATA_IO (SAFE.5), 08_PX4IO_V2 (R47.1)
SBUS_OUTPUT_PROT: 05_DATA_IO (RSSI1.2), 08_PX4IO_V2 (U14.3)
SCALED_V5_CH_IN: 02_B_TO_B_CON (CON3.38), 05_DATA_IO (ADC1.3)
SPI5_CS1_EX1: 02_B_TO_B_CON (CON3.57), 05_DATA_IO (SPI5.5)
SPI5_CS2_EX1: 02_B_TO_B_CON (CON3.6), 05_DATA_IO (SPI5.6)
UART4_RX_PORT: 02_B_TO_B_CON (CON3.73), 05_DATA_IO (U5.7)
UART4_TX_PORT: 02_B_TO_B_CON (CON3.72), 05_DATA_IO (U5.6)
UART7_RX: 05_DATA_IO (DEBUG1.3), 06_PWM_IO (R28#2.7)
UART7_RX_DEBUG: 02_B_TO_B_CON (CON3.35), 06_PWM_IO (U19.3)
UART7_TX: 05_DATA_IO (DEBUG1.2), 06_PWM_IO (R28#2.8)
UART7_TX_DEBUG: 02_B_TO_B_CON (CON3.36), 06_PWM_IO (U19.1)
UART8_RX_PORT: 02_B_TO_B_CON (CON3.75), 08_PX4IO_V2 (R20.2)
UART8_TX_PORT: 02_B_TO_B_CON (CON3.74), 08_PX4IO_V2 (R34.2)
USART1_GPS1_RX: 02_B_TO_B_CON (CON3.71), 05_DATA_IO (U5.4)
USART1_GPS1_TX: 02_B_TO_B_CON (CON3.70), 05_DATA_IO (U5.5)
USART2_CTS_PORT: 02_B_TO_B_CON (CON3.59), 05_DATA_IO (U6.5)
USART2_RTS_PORT: 02_B_TO_B_CON (CON3.60), 05_DATA_IO (U6.4)
USART2_RX_PORT: 02_B_TO_B_CON (CON3.62), 05_DATA_IO (U6.1)
USART2_TX_PORT: 02_B_TO_B_CON (CON3.61), 05_DATA_IO (U6.3)
USART3_CTS_PORT: 02_B_TO_B_CON (CON3.65), 05_DATA_IO (U6.8)
USART3_RTS_PORT: 02_B_TO_B_CON (CON3.66), 05_DATA_IO (U6.9)
USART3_RX_PORT: 02_B_TO_B_CON (CON3.64), 05_DATA_IO (U6.6)
USART3_TX_PORT: 02_B_TO_B_CON (CON3.63), 05_DATA_IO (U6.7)